# EAGLE schematic Prova02 (EAGLE 6.2)
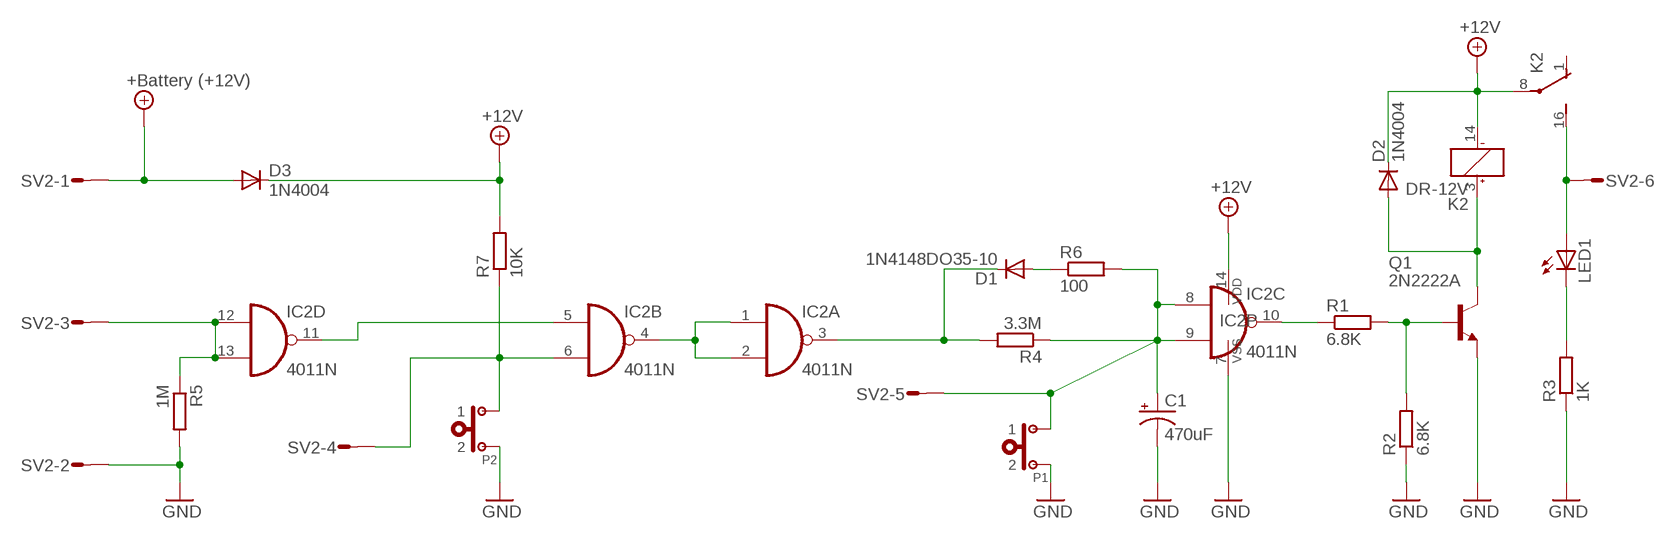
[diagram p0: schematic, sheet 1]

## Parts
C1  470uF  CPOL-USE3.5-8  [E3,5-8]
D1  1N4148DO35-10  [DO35-10]
D2  1N4004  [DO41-10]
D3  1N4004  [DO41-10]
IC2  4011N  [DIL14]
K2  DR-12V  [DR-1]
LED1  LED  [SMARTLED-TTW]
P1  PULSANTENO  [SIP02]
P2  PULSANTENO  [SIP02]
Q1  2N2222A  [TO18]
R1  6.8K  R-EU_0207/10  [0207/10]
R2  6.8K  R-EU_0207/10  [0207/10]
R3  1K  R-EU_0207/10  [0207/10]
R4  3.3M  R-EU_0207/10  [0207/10]
R5  1M  R-EU_0207/10  [0207/10]
R6  100  R-EU_0207/10  [0207/10]
R7  10K  R-EU_0207/10  [0207/10]
SV2  MT6-6  [MT6-6]

## Nets
+12V: D2.C D3.A D3.C IC2.14(P:VDD) K2.8(-2:P) K2.14(-1:-) R7.2 SV2.1 ; supply symbol labelled +Battery (+12V)
GND: C1.- IC2.7(P:VSS) P1.2 P2.2 Q1.1(E) R2.1 R3.1 R5.2 SV2.2
N$1: IC2.10(C:O) R1.1
N$2: Q1.2(B) R1.2 R2.2
N$3: D2.A K2.3(-1:+) Q1.3(C)
N$4: C1.+ IC2.8(C:I0) IC2.9(C:I1) P1.1 R4.1 R6.2 SV2.5
N$5: K2.16(-2:S) LED1.A@1(A) SV2.6
N$6: D1.A R6.1
N$7: D1.C IC2.3(A:O) R4.2
N$8: LED1.C@1(C) R3.2
N$9: IC2.12(D:I0) IC2.13(D:I1) R5.1 SV2.3
N$11: IC2.5(B:I0) IC2.11(D:O)
N$12: IC2.1(A:I0) IC2.2(A:I1) IC2.4(B:O)
N$14: IC2.6(B:I1) P2.1 R7.1 SV2.4
Unconnected: K2.1(-2:O)

## Library data of the parts
C1 = rcl:CPOL-US: POLARIZED CAPACITOR, American symbol
D1 = diode:1N4148: DIODE high speed (Philips)
D2 D3 = diode:1N4004: DIODE general purpose rectifier, 1 A
IC2 = 40xx:4011: Quad 2-input NAND
K2 = relay:DR-*V: HIGHLY RELIABLE MINIATURE DIP RELAYS NAiS Source: www.mew-europe.com/ac/download/ datasheet/relay/dr_en.pdf; MPN: DR-12V; OC_FARNELL: 1124066; OC_NEWARK: 91K6794
LED1 = led:LED: LED OSRAM: - CHIPLED LG R971, LG N971, LY N971, LG Q971, LY Q971, LO R971, LY R971 LH N974, LH R974 LS Q976, LO Q976, LY Q976 LO Q996 - Hyper CHIPLED LW Q18S LB Q993, LB Q99A, LB R99A - SideLED LS A670, LO A670, LY A670, LG A670, LP A670 LB A673, LV A673, LT A673, LW A673 LH A674 LY A675 LS A676, LA A676, LO A676, LY A676, LW A676 LS A679, LY A679, LG A679 - Hyper Micro SIDELED® LS Y876, LA Y876, LO Y876, LY Y876 LT Y87S - SmartLED LW L88C, LW L88S LB L89C, LB L89S, LG L890 LS L89K, LO L89K, LY L89K LS L896, LA L896, LO L896, LY L896 - TOPLED LS T670, LO T670, LY T670, LG T670, LP T670 LSG T670, LSP T670, LSY T670, LOP T670, LYG T670 LG T671, LOG T671, LSG T671 LB T673, LV T673, LT T673, LW T673 LH T674 LS T676, LA T676, LO T676, LY T676, LB T676, LH T676, LSB T676, LW T676 LB T67C, LV T67C, LT T67C, LS T67K, LO T67K, LY T67K, LW E67C LS E67B, LA E67B, LO E67B, LY E67B, LB E67C, LV E67C, LT E67C LW T67C LS T679, LY T679, LG T679 LS T770, LO T770, LY T770, LG T770, LP T770 LB T773, LV T773, LT T773, LW T773 LH T774 LS E675, LA E675, LY E675, LS T675 LS T776, LA T776, LO T776, LY T776, LB T776 LHGB T686 LT T68C, LB T68C - Hyper Mini TOPLED® LB M676 - Mini TOPLED Santana® LG M470 LS M47K, LO M47K, LY M47K Source: http://www.osram.convergy.de LUXEON: - LUMILED® LXK2-PW12-R00, LXK2-PW12-S00, LXK2-PW14-U00, LXK2-PW14-V00 LXK2-PM12-R00, LXK2-PM12-S00, LXK2-PM14-U00 LXK2-PE12-Q00, LXK2-PE12-R00, LXK2-PE12-S00, LXK2-PE14-T00, LXK2-PE14-U00 LXK2-PB12-K00, LXK2-PB12-L00, LXK2-PB12-M00, LXK2-PB14-N00, LXK2-PB14-P00, LXK2-PB14-Q00 LXK2-PR12-L00, LXK2-PR12-M00, LXK2-PR14-Q00, LXK2-PR14-R00 LXK2-PD12-Q00, LXK2-PD12-R00, LXK2-PD12-S00 LXK2-PH12-R00, LXK2-PH12-S00 LXK2-PL12-P00, LXK2-PL12-Q00, LXK2-PL12-R00 Source: www.luxeon.com KINGBRIGHT: KA-3528ASYC Source: www.kingbright.com
P1 P2 = Loreto:PULSANTENO
Q1 = transistor-npn:2N2222*: NPN Transistor
R1-R7 = rcl:R-EU_: RESISTOR, European symbol
SV2 = con-amp-mt6:MT6-6: AMP MT6 CONNECTOR; OC_FARNELL: unknown; OC_NEWARK: unknown